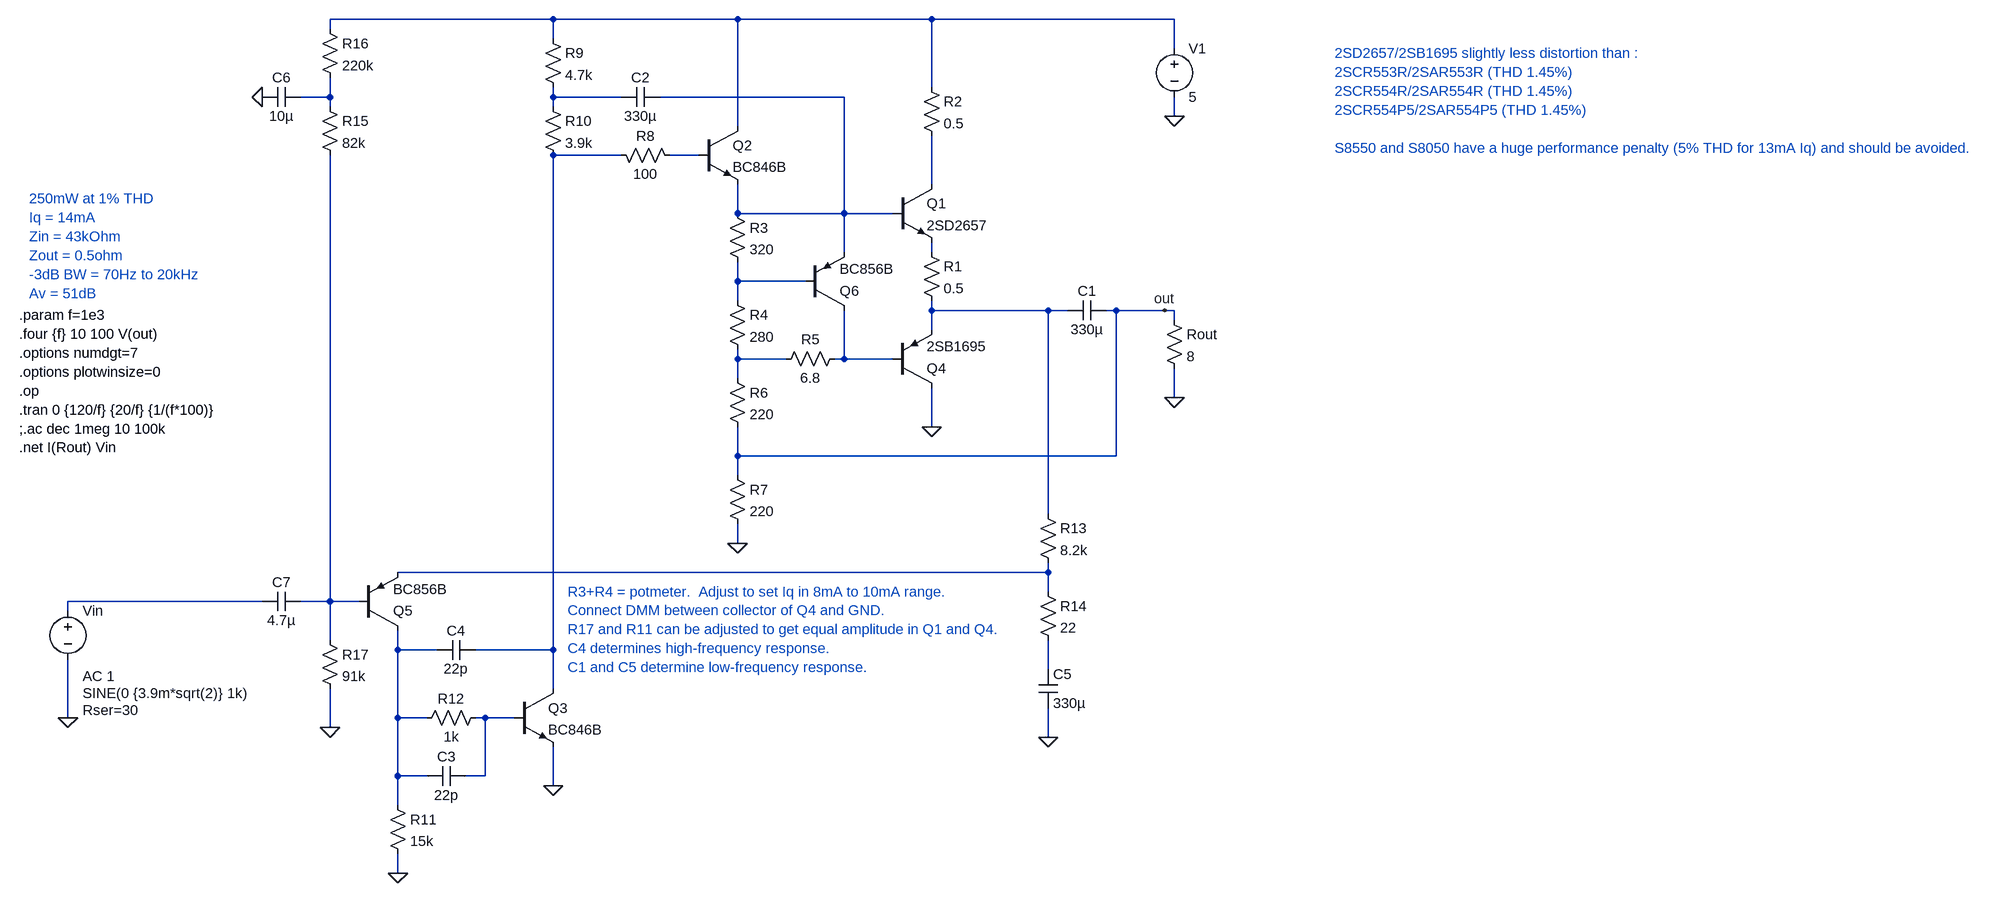
[diagram p0: schematic grundig_city_boy_100.asc]
grundig_city_boy_100.asc, the LTspice schematic file:
Version 4
SHEET 1 2052 1284
WIRE -384 -256 -752 -256
WIRE -80 -256 -384 -256
WIRE 240 -256 -80 -256
WIRE 640 -256 240 -256
WIRE -752 -240 -752 -256
WIRE -384 -224 -384 -256
WIRE 640 -208 640 -256
WIRE 240 -144 240 -256
WIRE -752 -128 -752 -160
WIRE -752 -128 -800 -128
WIRE -384 -128 -384 -144
WIRE -272 -128 -384 -128
WIRE 96 -128 -208 -128
WIRE -752 -112 -752 -128
WIRE -384 -112 -384 -128
WIRE 640 -96 640 -128
WIRE -80 -80 -80 -256
WIRE -272 -32 -384 -32
WIRE -144 -32 -192 -32
WIRE 240 16 240 -64
WIRE -80 64 -80 16
WIRE 96 64 96 -128
WIRE 96 64 -80 64
WIRE 176 64 96 64
WIRE 96 128 96 64
WIRE 240 128 240 112
WIRE -80 176 -80 144
WIRE 32 176 -80 176
WIRE -80 208 -80 176
WIRE 240 224 240 208
WIRE 432 224 240 224
WIRE 464 224 432 224
WIRE 544 224 528 224
WIRE 624 224 544 224
WIRE 640 224 624 224
WIRE 640 240 640 224
WIRE 240 256 240 224
WIRE -80 304 -80 288
WIRE 0 304 -80 304
WIRE 96 304 96 224
WIRE 96 304 80 304
WIRE 176 304 96 304
WIRE -80 336 -80 304
WIRE 640 368 640 320
WIRE 240 416 240 352
WIRE -80 464 -80 416
WIRE 544 464 544 224
WIRE 544 464 -80 464
WIRE -80 496 -80 464
WIRE 432 560 432 224
WIRE -80 608 -80 576
WIRE 432 656 432 640
WIRE 432 656 -640 656
WIRE 432 688 432 656
WIRE -864 704 -1184 704
WIRE -752 704 -752 -32
WIRE -752 704 -800 704
WIRE -704 704 -752 704
WIRE -1184 720 -1184 704
WIRE -752 768 -752 704
WIRE -640 784 -640 752
WIRE -576 784 -640 784
WIRE -384 784 -384 -32
WIRE -384 784 -512 784
WIRE 432 816 432 768
WIRE -384 848 -384 784
WIRE -1184 896 -1184 800
WIRE -640 896 -640 784
WIRE -592 896 -640 896
WIRE -496 896 -512 896
WIRE -448 896 -496 896
WIRE -752 912 -752 848
WIRE 432 928 432 880
WIRE -640 992 -640 896
WIRE -592 992 -640 992
WIRE -496 992 -496 896
WIRE -496 992 -528 992
WIRE -384 1008 -384 944
WIRE -640 1040 -640 992
WIRE -640 1152 -640 1120
FLAG 240 416 0
FLAG 640 368 0
FLAG 640 -96 0
FLAG -80 608 0
FLAG -384 1008 0
FLAG -640 1152 0
FLAG 432 928 0
FLAG -752 912 0
FLAG -864 -128 0
FLAG -1184 896 0
FLAG 624 224 out
DATAFLAG 352 224 ""
SYMBOL npn 176 16 R0
SYMATTR InstName Q1
SYMATTR Value 2SD2657
SYMBOL npn -144 -80 R0
SYMATTR InstName Q2
SYMATTR Value BC846B
SYMBOL pnp 176 352 M180
SYMATTR InstName Q4
SYMATTR Value 2SB1695
SYMBOL res 224 112 R0
SYMATTR InstName R1
SYMATTR Value 0.5
SYMBOL cap 528 208 R90
WINDOW 0 0 32 VBottom 2
WINDOW 3 32 32 VTop 2
SYMATTR InstName C1
SYMATTR Value 330µ
SYMBOL res 624 224 R0
SYMATTR InstName Rout
SYMATTR Value 8
SYMBOL voltage 640 -224 R0
SYMATTR InstName V1
SYMATTR Value 5
SYMBOL pnp 32 224 M180
SYMATTR InstName Q6
SYMATTR Value BC856B
SYMBOL res -96 48 R0
SYMATTR InstName R3
SYMATTR Value 320
SYMBOL res -96 192 R0
SYMATTR InstName R4
SYMATTR Value 280
SYMBOL res 96 288 R90
WINDOW 0 0 56 VBottom 2
WINDOW 3 32 56 VTop 2
SYMATTR InstName R5
SYMATTR Value 6.8
SYMBOL res -96 320 R0
SYMATTR InstName R6
SYMATTR Value 220
SYMBOL res -96 480 R0
SYMATTR InstName R7
SYMATTR Value 220
SYMBOL res -288 -48 M90
WINDOW 0 0 56 VBottom 2
WINDOW 3 32 56 VTop 2
SYMATTR InstName R8
SYMATTR Value 100
SYMBOL cap -208 -144 R90
WINDOW 0 0 32 VBottom 2
WINDOW 3 32 32 VTop 2
SYMATTR InstName C2
SYMATTR Value 330µ
SYMBOL res -400 -240 R0
SYMATTR InstName R9
SYMATTR Value 4.7k
SYMBOL res -400 -128 R0
SYMATTR InstName R10
SYMATTR Value 3.9k
SYMBOL npn -448 848 R0
SYMATTR InstName Q3
SYMATTR Value BC846B
SYMBOL res -656 1024 R0
SYMATTR InstName R11
SYMATTR Value 15k
SYMBOL res -496 880 R90
WINDOW 0 0 56 VBottom 2
WINDOW 3 32 56 VTop 2
SYMATTR InstName R12
SYMATTR Value 1k
SYMBOL cap -528 976 R90
WINDOW 0 0 32 VBottom 2
WINDOW 3 32 32 VTop 2
SYMATTR InstName C3
SYMATTR Value 22p
SYMBOL cap -512 768 R90
WINDOW 0 0 32 VBottom 2
WINDOW 3 32 32 VTop 2
SYMATTR InstName C4
SYMATTR Value 22p
SYMBOL res 416 544 R0
SYMATTR InstName R13
SYMATTR Value 8.2k
SYMBOL res 416 672 R0
SYMATTR InstName R14
SYMATTR Value 22
SYMBOL cap 416 816 R0
SYMATTR InstName C5
SYMATTR Value 330µ
SYMBOL pnp -704 752 M180
SYMATTR InstName Q5
SYMATTR Value BC856B
SYMBOL res -768 -128 R0
SYMATTR InstName R15
SYMATTR Value 82k
SYMBOL res -768 -256 R0
SYMATTR InstName R16
SYMATTR Value 220k
SYMBOL cap -800 -144 R90
WINDOW 0 0 32 VBottom 2
WINDOW 3 32 32 VTop 2
SYMATTR InstName C6
SYMATTR Value 10µ
SYMBOL res -768 752 R0
SYMATTR InstName R17
SYMATTR Value 91k
SYMBOL cap -800 688 R90
WINDOW 0 0 32 VBottom 2
WINDOW 3 32 32 VTop 2
SYMATTR InstName C7
SYMATTR Value 4.7µ
SYMBOL voltage -1184 704 R0
WINDOW 3 24 152 Left 2
WINDOW 123 24 124 Left 2
WINDOW 39 24 180 Left 2
SYMATTR Value SINE(0 {3.9m*sqrt(2)} 1k)
SYMATTR Value2 AC 1
SYMATTR SpiceLine Rser=30
SYMATTR InstName Vin
SYMBOL res 224 -160 R0
SYMATTR InstName R2
SYMATTR Value 0.5
TEXT -1264 232 Left 2 !.param f=1e3\n.four {f} 10 100 V(out)\n.options numdgt=7\n.options plotwinsize=0\n.op\n.tran 0 {120/f} {20/f} {1/(f*100)}\n;.ac dec 1meg 10 100k\n.net I(Rout) Vin
TEXT -1248 40 Left 2 ;250mW at 1% THD\nIq = 14mA\nZin = 43kOhm\nZout = 0.5ohm\n-3dB BW = 70Hz to 20kHz\nAv = 51dB
TEXT -360 688 Left 2 ;R3+R4 = potmeter.  Adjust to set Iq in 8mA to 10mA range.  \nConnect DMM between collector of Q4 and GND.\nR17 and R11 can be adjusted to get equal amplitude in Q1 and Q4.\nC4 determines high-frequency response.\nC1 and C5 determine low-frequency response.
TEXT 904 -200 Left 2 ;2SD2657/2SB1695 slightly less distortion than :\n2SCR553R/2SAR553R (THD 1.45%)\n2SCR554R/2SAR554R (THD 1.45%)\n2SCR554P5/2SAR554P5 (THD 1.45%)\n \nS8550 and S8050 have a huge performance penalty (5% THD for 13mA Iq) and should be avoided.

The netlist it stands for:
* grundig_city_boy_100.asc
Q1 N007 N004 N008 0 2SD2657
Q2 N001 N006 N004 0 BC846B
Q4 0 N012 N010 0 2SB1695
R1 N008 N010 0.5
C1 out N010 330µ
Rout out 0 8
V1 N001 0 5
Q6 N012 N009 N004 0 BC856B
R3 N004 N009 320
R4 N009 N011 280
R5 N012 N011 6.8
R6 N011 out 220
R7 out 0 220
R8 N005 N006 100
C2 N004 N003 330µ
R9 N001 N003 4.7k
R10 N003 N005 3.9k
Q3 N005 N018 0 0 BC846B
R11 N016 0 15k
R12 N018 N016 1k
C3 N018 N016 22p
C4 N005 N016 22p
R13 N010 N013 8.2k
R14 N013 N017 22
C5 N017 0 330µ
Q5 N016 N015 N013 0 BC856B
R15 N002 N015 82k
R16 N001 N002 220k
C6 N002 0 10µ
R17 N015 0 91k
C7 N015 N014 4.7µ
Vin N014 0 SINE(0 {3.9m*sqrt(2)} 1k) AC 1 Rser=30
R2 N001 N007 0.5
.model NPN NPN
.model PNP PNP
.lib standard.bjt
.param f=1e3
.four {f} 10 100 V(out)
.options numdgt=7
.options plotwinsize=0
.op
.tran 0 {120/f} {20/f} {1/(f*100)}
;.ac dec 1meg 10 100k
.net I(Rout) Vin
* 250mW at 1% THD
* Iq = 14mA
* Zin = 43kOhm
* Zout = 0.5ohm
* -3dB BW = 70Hz to 20kHz
* Av = 51dB
* R3+R4 = potmeter.  Adjust to set Iq in 8mA to 10mA range.
* Connect DMM between collector of Q4 and GND.
* R17 and R11 can be adjusted to get equal amplitude in Q1 and Q4.
* C4 determines high-frequency response.
* C1 and C5 determine low-frequency response.
* 2SD2657/2SB1695 slightly less distortion than :
* 2SCR553R/2SAR553R (THD 1.45%)
* 2SCR554R/2SAR554R (THD 1.45%)
* 2SCR554P5/2SAR554P5 (THD 1.45%)
* S8550 and S8050 have a huge performance penalty (5% THD for 13mA Iq) and should be avoided.
.backanno
.end